# Altium schematic sheet DC_SIGNAL_FILTER.SchDoc
size A; SheetNumber: 1; SheetTotal: 1
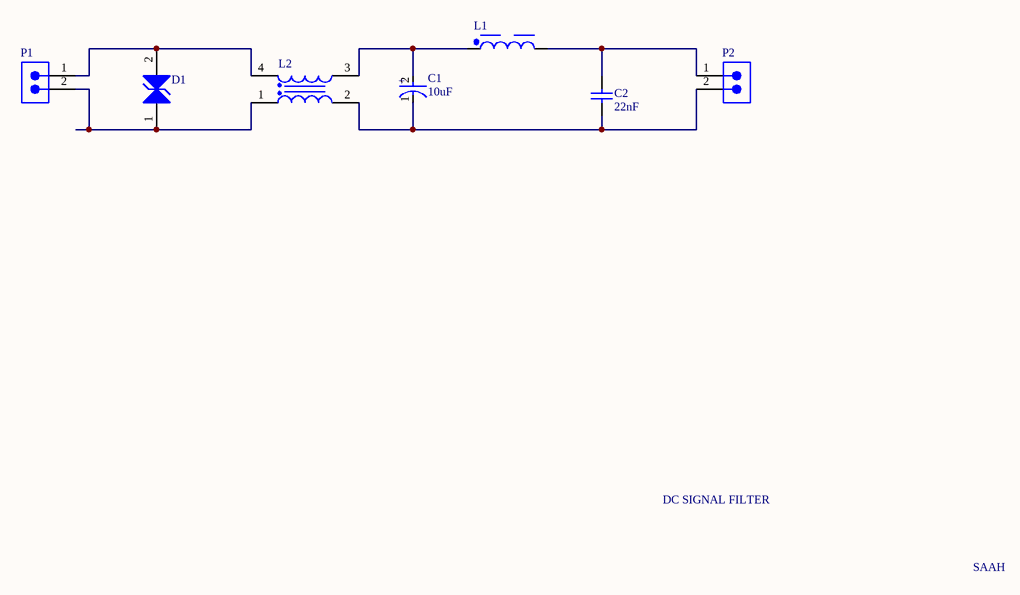
[diagram p0: DC_SIGNAL_FILTER.SchDoc]

## Parts
C1  10uF  [FP-HDF-MFG]
C2  22nF  [WCAP-FTXX_L13W4.5H9.5_CS]
D1  824501500  [WE-TVSP_DO-214AC_Bidirectional]  (value not drawn)
L1  768775282  [WE-PD2 HV_7850]  (value not drawn)
L2  744235251  [WE-CNSW_1812]  (value not drawn)
P1  653102124022  [653102124022]  (value not drawn)
P2  653102124022  [653102124022]  (value not drawn)

## Nets
NetC1_1: C1.1(C) C2.1 L2.2 P2.2
NetC1_2: C1.2(A) L1.1 L2.3
NetC2_2: C2.2 L1.2 P2.1
NetD1_1: D1.1 L2.1 P1.2
NetD1_2: D1.2 L2.4 P1.1

## Notes on the sheet
- DC SIGNAL FILTER
- SAAH
- (in symbol CMP-05427-000023-1) +

## Library data of the parts
C1 = CMP-05427-000023-1: CAP ALUM 10UF 20% 100V SMD; Dissipation Factor: 0.18%; Ripple Current (AC): 55mA; Impedance: 1.5R; Polarity: Polar; Leakage Current: 3uA; Life (Hours): 5000Hour; Dielectric Material: Aluminium; RoHS Compliant: Yes; Height: 10.2mm; Max Operating Temperature: 105°C; Termination: SMD/SMT; Number of Pins: 2; Lead Pitch: 3.1mm; Diameter: 8mm; Package Quantity: 1; Height - Seated (Max): 0.402inch; Radiation Hardening: No; Packaging: Tape and Reel; Construction: Cylindrical; Voltage Rating (DC): 100V; ESR (Equivalent Series Resistance): 1.5R; Voltage: 100V; Ripple Current: 55mA; Capacitance: 10uF; Mount: Surface Mount; Tolerance: 20%; Series: HD; Length: 10.2mm; Lead Free: Lead Free; Min Operating Temperature: -40°C; Voltage Rating: 100V; Case/Package: Radial; Contact Plating: Tin
C2 = CMP-03913-51400141-2: 890334023011CS WCAP-FTXX Film Capacitor 22nF 310Vac; Pin Length: 4mm; Hole Diameter: 900µm; Dielectric Material: PP; Insulation Resistance: 30GΩ; Voltage Rating (DC): 310V; Pitch: 10mm; Tolerance: 10%; Min Operating Temperature: -40°C; Max Operating Temperature: 105°C; Voltage Rating: 310V; Capacitance: 22nF; Packaging: Carton; Dielectric: PP; Case/Package: Radial; Mount: Through Hole; Height: 9.5mm; Length: 13mm; Termination: PC Pins; Width: 4.5mm; Lead Pitch: 10.0076mm; Voltage Rating (AC): 310V; Height - Seated (Max): 10.0076mm; NexarPartId: 51400141; RoHS: Compliant; REACH SVHC: Unknown
D1 = CMP-03913-71101561-1: 824501500 WE-TVSP Power TVS Diode; Number of Bidirectional Channels: 1; Reverse Standoff Voltage: 5V; Peak Pulse Current: 43.5A; Breakdown Voltage: 6.7V; Leakage Current: 1.6mA; Clamping Voltage: 9.2V; Power Line Protection: No; Polarity: Bidirectional; Peak Pulse Power: 400W; Number of Pins: 2; Mount: Surface Mount; NexarPartId: 71101561; Height: 2.25mm; Max Operating Temperature: 150°C; RoHS: Compliant; Max Breakdown Voltage: 6.7V; Min Breakdown Voltage: 6.7V; REACH SVHC: Unknown; Width: 2.67mm; Min Operating Temperature: -65°C; Packaging: Cut Tape; Length: 4.24mm; Composition: Zener
L1 = CMP-1386-00005-3: NexarPartId: 24533376; Self Resonant Frequency: 2.6MHz; Series Resistance: 2.77Ω; Inductance Tolerance: 10%; Core Material: Ferrite; RMS Current (Irms): 350mA; DC Resistance (DCR): 2.35Ω; Inductance: 820µH; Test Frequency: 100kHz; Packaging: Tape & Reel (TR); Ambient Temperature Range High: 85°C; Current Rating: 350mA; Max Operating Temperature: 125°C; Min Operating Temperature: -40°C; Length: 7mm; Case/Package: 7850; Width: 7.8mm; Composition: Wirewound; Height: 5mm; Ambient Temperature Range Low: -40°C; Saturation Current: 350mA; Tolerance: 10%; RoHS: Compliant
L2 = CMP-207849-000006-2: CMC 250UH 200MA 2LN SMD AEC-Q200; NexarPartId: 110288118; Test Frequency: 10kHz; Tolerance: 25%; Inductance: 250µH; Series Resistance: 1.6Ω; Voltage Rating: 60V; Composition: Wirewound; Ambient Temperature Range Low: -40°C; RMS Current (Irms): 200mA; Current Rating: 200mA; Width: 3.2mm; Max Operating Temperature: 125°C; Min Operating Temperature: -40°C; Length: 4.5mm; Height: 2.8mm; Ambient Temperature Range High: 85°C; RoHS: Compliant
P1 P2 = CMP-1502-00757-2: NexarPartId: 18818273; Current Rating: 1A; Pitch: 1.25mm; Gender: Male; Connector Type: Male Pin; Insulation Resistance: 100MΩ; Contact Resistance: 20mΩ; Operating Supply Voltage: 125V; Number of Positions: 2; Insulation: Insulated; Number of Pins: 2; Flammability Rating: UL94 V-0; Number of Rows: 1; Termination: SMD/SMT; Width: 7.25mm; Contact Material: Copper; Color: Beige, White; Contact Gender: Male; Housing Material: Nylon; Contact Mating Length: 2.159mm; RoHS: Compliant; Orientation: Vertical; Min Operating Temperature: -40°C; Max Operating Temperature: 85°C; Voltage Rating: 125V; Height: 4.75mm; Packaging: Tape and Reel; Lead Pitch: 1.25mm; Mount: Surface Mount; REACH SVHC: Unknown; Contact Plating: Tin; Length: 7.25mm; Number of Contacts: 2